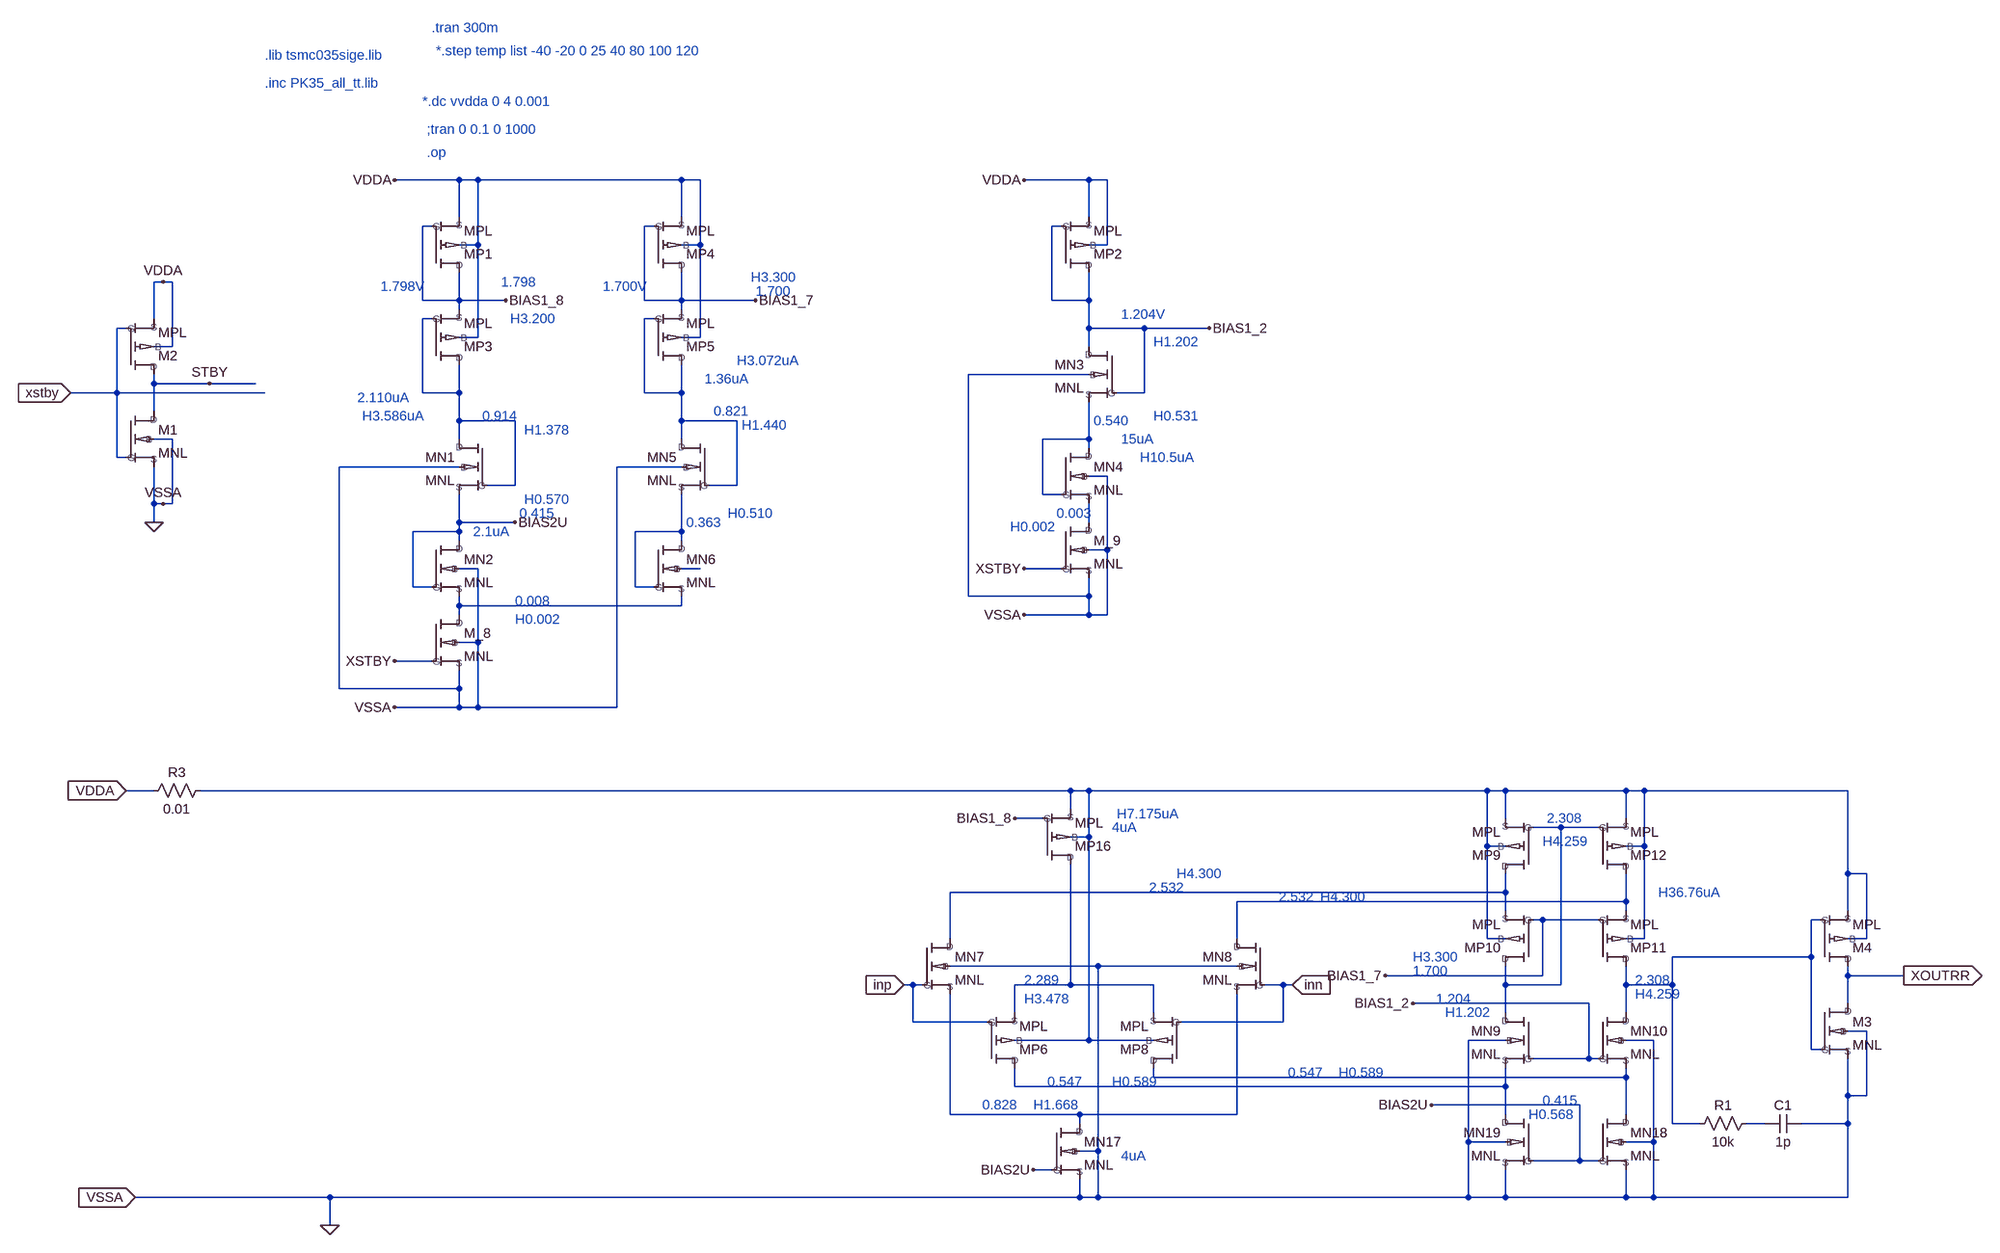
[diagram p0: schematic COMP_RR5V_orig.asc]
COMP_RR5V_orig.asc, the LTspice schematic file:
Version 4
SHEET 1 3512 5012
WIRE 352 1312 240 1312
WIRE 384 1312 352 1312
WIRE 736 1312 384 1312
WIRE 768 1312 736 1312
WIRE 1440 1312 1328 1312
WIRE 1472 1312 1440 1312
WIRE 352 1376 352 1312
WIRE 736 1376 736 1312
WIRE 1440 1376 1440 1312
WIRE 304 1392 288 1392
WIRE 688 1392 672 1392
WIRE 1392 1392 1376 1392
WIRE 384 1424 384 1312
WIRE 384 1424 352 1424
WIRE 768 1424 768 1312
WIRE 768 1424 736 1424
WIRE 1472 1424 1472 1312
WIRE 1472 1424 1440 1424
WIRE -160 1488 -176 1488
WIRE -144 1488 -160 1488
WIRE 288 1520 288 1392
WIRE 352 1520 352 1472
WIRE 352 1520 288 1520
WIRE 432 1520 352 1520
WIRE 672 1520 672 1392
WIRE 736 1520 736 1472
WIRE 736 1520 672 1520
WIRE 864 1520 736 1520
WIRE 1376 1520 1376 1392
WIRE 1440 1520 1440 1472
WIRE 1440 1520 1376 1520
WIRE 352 1536 352 1520
WIRE 736 1536 736 1520
WIRE -176 1552 -176 1488
WIRE 304 1552 288 1552
WIRE 688 1552 672 1552
WIRE -224 1568 -240 1568
WIRE 1440 1568 1440 1520
WIRE 1536 1568 1440 1568
WIRE 1648 1568 1536 1568
WIRE 384 1584 384 1424
WIRE 384 1584 352 1584
WIRE 768 1584 768 1424
WIRE 768 1584 736 1584
WIRE -144 1600 -144 1488
WIRE -144 1600 -176 1600
WIRE 1440 1600 1440 1568
WIRE 1440 1648 1232 1648
WIRE -176 1664 -176 1648
WIRE -80 1664 -176 1664
WIRE 0 1664 -80 1664
WIRE -240 1680 -240 1568
WIRE -240 1680 -320 1680
WIRE 16 1680 -240 1680
WIRE 288 1680 288 1552
WIRE 352 1680 352 1632
WIRE 352 1680 288 1680
WIRE 672 1680 672 1552
WIRE 736 1680 736 1632
WIRE 736 1680 672 1680
WIRE 1536 1680 1536 1568
WIRE 1536 1680 1488 1680
WIRE -176 1712 -176 1664
WIRE 352 1728 352 1680
WIRE 448 1728 352 1728
WIRE 736 1728 736 1680
WIRE 832 1728 736 1728
WIRE -144 1760 -176 1760
WIRE 352 1760 352 1728
WIRE 736 1760 736 1728
WIRE 1440 1760 1440 1696
WIRE 1440 1760 1360 1760
WIRE 1440 1776 1440 1760
WIRE -240 1792 -240 1680
WIRE -224 1792 -240 1792
WIRE 352 1808 144 1808
WIRE 736 1808 624 1808
WIRE 1472 1824 1440 1824
WIRE 448 1840 448 1728
WIRE 448 1840 400 1840
WIRE 832 1840 832 1728
WIRE 832 1840 784 1840
WIRE 1360 1856 1360 1760
WIRE 1392 1856 1360 1856
WIRE -176 1872 -176 1808
WIRE -160 1872 -176 1872
WIRE -144 1872 -144 1760
WIRE -144 1872 -160 1872
WIRE -176 1904 -176 1872
WIRE 352 1904 352 1856
WIRE 448 1904 352 1904
WIRE 1440 1904 1440 1872
WIRE 352 1920 352 1904
WIRE 352 1920 272 1920
WIRE 736 1920 736 1856
WIRE 736 1920 656 1920
WIRE 352 1936 352 1920
WIRE 736 1936 736 1920
WIRE 1472 1952 1472 1824
WIRE 1472 1952 1440 1952
WIRE 384 1984 352 1984
WIRE 768 1984 736 1984
WIRE 1392 1984 1328 1984
WIRE 272 2016 272 1920
WIRE 304 2016 272 2016
WIRE 656 2016 656 1920
WIRE 688 2016 656 2016
WIRE 1232 2032 1232 1648
WIRE 1440 2032 1440 2000
WIRE 1440 2032 1232 2032
WIRE 352 2048 352 2032
WIRE 736 2048 736 2032
WIRE 736 2048 352 2048
WIRE 352 2064 352 2048
WIRE 1440 2064 1440 2032
WIRE 1440 2064 1328 2064
WIRE 1472 2064 1472 1952
WIRE 1472 2064 1440 2064
WIRE 384 2112 384 1984
WIRE 384 2112 352 2112
WIRE 304 2144 240 2144
WIRE 144 2192 144 1808
WIRE 352 2192 352 2160
WIRE 352 2192 144 2192
WIRE 352 2224 352 2192
WIRE 352 2224 240 2224
WIRE 384 2224 384 2112
WIRE 384 2224 352 2224
WIRE 624 2224 624 1808
WIRE 624 2224 384 2224
WIRE -176 2368 -224 2368
WIRE 1408 2368 -96 2368
WIRE 1440 2368 1408 2368
WIRE 2128 2368 1440 2368
WIRE 2160 2368 2128 2368
WIRE 2368 2368 2160 2368
WIRE 2400 2368 2368 2368
WIRE 2752 2368 2400 2368
WIRE 1408 2400 1408 2368
WIRE 1360 2416 1312 2416
WIRE 2160 2416 2160 2368
WIRE 2368 2416 2368 2368
WIRE 2256 2432 2208 2432
WIRE 2320 2432 2256 2432
WIRE 1440 2448 1440 2368
WIRE 1440 2448 1408 2448
WIRE 2128 2464 2128 2368
WIRE 2160 2464 2128 2464
WIRE 2400 2464 2400 2368
WIRE 2400 2464 2368 2464
WIRE 2752 2512 2752 2368
WIRE 2784 2512 2752 2512
WIRE 2160 2544 2160 2512
WIRE 2160 2544 1200 2544
WIRE 2368 2560 2368 2512
WIRE 2368 2560 1696 2560
WIRE 2160 2576 2160 2544
WIRE 2368 2576 2368 2560
WIRE 2752 2576 2752 2512
WIRE 2224 2592 2208 2592
WIRE 2320 2592 2224 2592
WIRE 2704 2592 2688 2592
WIRE 1200 2624 1200 2544
WIRE 1696 2624 1696 2560
WIRE 2128 2624 2128 2464
WIRE 2160 2624 2128 2624
WIRE 2400 2624 2400 2464
WIRE 2400 2624 2368 2624
WIRE 2784 2624 2784 2512
WIRE 2784 2624 2752 2624
WIRE 2688 2656 2688 2592
WIRE 2688 2656 2448 2656
WIRE 1456 2672 1200 2672
WIRE 1696 2672 1456 2672
WIRE 2224 2688 2224 2592
WIRE 2224 2688 1952 2688
WIRE 2752 2688 2752 2672
WIRE 2848 2688 2752 2688
WIRE 1136 2704 1120 2704
WIRE 1152 2704 1136 2704
WIRE 1408 2704 1408 2496
WIRE 1408 2704 1312 2704
WIRE 1552 2704 1408 2704
WIRE 1776 2704 1744 2704
WIRE 1792 2704 1776 2704
WIRE 2160 2704 2160 2672
WIRE 2256 2704 2256 2432
WIRE 2256 2704 2160 2704
WIRE 2368 2704 2368 2672
WIRE 2448 2704 2448 2656
WIRE 2448 2704 2368 2704
WIRE 2304 2736 2000 2736
WIRE 2752 2736 2752 2688
WIRE 1312 2752 1312 2704
WIRE 1552 2752 1552 2704
WIRE 2160 2752 2160 2704
WIRE 2368 2752 2368 2704
WIRE 1136 2768 1136 2704
WIRE 1264 2768 1136 2768
WIRE 1776 2768 1776 2704
WIRE 1776 2768 1600 2768
WIRE 2784 2784 2752 2784
WIRE 1440 2800 1440 2448
WIRE 1440 2800 1312 2800
WIRE 1552 2800 1440 2800
WIRE 2160 2800 2096 2800
WIRE 2416 2800 2368 2800
WIRE 2688 2816 2688 2656
WIRE 2704 2816 2688 2816
WIRE 2304 2832 2304 2736
WIRE 2304 2832 2208 2832
WIRE 2320 2832 2304 2832
WIRE 1552 2864 1552 2848
WIRE 2368 2864 2368 2848
WIRE 2368 2864 1552 2864
WIRE 1312 2880 1312 2848
WIRE 2160 2880 2160 2848
WIRE 2160 2880 1312 2880
WIRE 2752 2896 2752 2832
WIRE 2784 2896 2784 2784
WIRE 2784 2896 2752 2896
WIRE 2288 2912 2032 2912
WIRE 1200 2928 1200 2720
WIRE 1424 2928 1200 2928
WIRE 1696 2928 1696 2720
WIRE 1696 2928 1424 2928
WIRE 2160 2928 2160 2880
WIRE 2368 2928 2368 2864
WIRE 1424 2944 1424 2928
WIRE 2448 2944 2448 2704
WIRE 2496 2944 2448 2944
WIRE 2608 2944 2576 2944
WIRE 2752 2944 2752 2896
WIRE 2752 2944 2672 2944
WIRE 2096 2976 2096 2800
WIRE 2160 2976 2096 2976
WIRE 2416 2976 2416 2800
WIRE 2416 2976 2368 2976
WIRE 1456 2992 1456 2672
WIRE 1456 2992 1424 2992
WIRE 2288 3008 2288 2912
WIRE 2288 3008 2208 3008
WIRE 2320 3008 2288 3008
WIRE 1376 3024 1344 3024
WIRE 128 3072 -208 3072
WIRE 1424 3072 1424 3040
WIRE 1424 3072 128 3072
WIRE 1456 3072 1456 2992
WIRE 1456 3072 1424 3072
WIRE 2096 3072 2096 2976
WIRE 2096 3072 1456 3072
WIRE 2160 3072 2160 3024
WIRE 2160 3072 2096 3072
WIRE 2368 3072 2368 3024
WIRE 2368 3072 2160 3072
WIRE 2416 3072 2416 2976
WIRE 2416 3072 2368 3072
WIRE 2752 3072 2752 2944
WIRE 2752 3072 2416 3072
WIRE 128 3120 128 3072
FLAG -320 1680 xstby
IOPIN -320 1680 In
FLAG -160 1488 VDDA
FLAG -160 1872 VSSA
FLAG -80 1664 STBY
FLAG -176 1904 0
FLAG 240 1312 VDDA
FLAG 240 2144 XSTBY
FLAG 240 2224 VSSA
FLAG 1328 1312 VDDA
FLAG 1328 1984 XSTBY
FLAG 1328 2064 VSSA
FLAG 1120 2704 inp
IOPIN 1120 2704 In
FLAG 1792 2704 inn
IOPIN 1792 2704 In
FLAG 128 3120 0
FLAG 448 1904 BIAS2U
FLAG 432 1520 BIAS1_8
FLAG 864 1520 BIAS1_7
FLAG 1648 1568 BIAS1_2
FLAG 2000 2736 BIAS1_2
FLAG 1952 2688 BIAS1_7
FLAG 1344 3024 BIAS2U
FLAG 1312 2416 BIAS1_8
FLAG 2032 2912 BIAS2U
FLAG 2848 2688 XOUTRR
IOPIN 2848 2688 Out
FLAG -224 2368 VDDA
IOPIN -224 2368 In
FLAG -208 3072 VSSA
IOPIN -208 3072 In
SYMBOL MNL -192 1760 R0
SYMATTR InstName M1
SYMATTR SpiceLine l=1.0u w=5.0u pd=w+l+l ps=pd ad=w*l as=ad m=1
SYMBOL MPL -192 1600 M180
SYMATTR InstName M2
SYMATTR SpiceLine l=1.0u w=10.0u pd=w+l+l ps=pd ad=w*l as=ad m=1
SYMBOL MPL 336 1424 M180
SYMATTR InstName MP1
SYMATTR SpiceLine l=22u w=3.3u pd=w+l+l ps=pd ad=w*l as=ad m=1
SYMBOL MNL 368 1808 M0
SYMATTR InstName MN1
SYMATTR SpiceLine l=10.u w=10.6u pd=w+l+l ps=pd ad=w*l as=ad m=1
SYMBOL MNL 336 1984 R0
SYMATTR InstName MN2
SYMATTR SpiceLine l=4.0u w=10.0u pd=w+l+l ps=pd ad=w*l as=ad m=1
SYMBOL MNL 336 2112 R0
SYMATTR InstName M_8
SYMATTR SpiceLine l=1.2u w=24u pd=w+l+l ps=pd ad=w*l as=ad m=1
SYMBOL MPL 1424 1424 M180
SYMATTR InstName MP2
SYMATTR SpiceLine l=40u w=3.3u pd=w+l+l ps=pd ad=w*l as=ad m=1
SYMBOL MNL 1456 1648 M0
SYMATTR InstName MN3
SYMATTR SpiceLine l=4u w=22u pd=w+l+l ps=pd ad=w*l as=ad m=2
SYMBOL MNL 1424 1824 R0
SYMATTR InstName MN4
SYMATTR SpiceLine l=4u w=22u pd=w+l+l ps=pd ad=w*l as=ad m=2
SYMBOL MNL 1424 1952 R0
SYMATTR InstName M_9
SYMATTR SpiceLine l=1.2u w=24u pd=w+l+l ps=pd ad=w*l as=ad m=1
SYMBOL MPL 336 1584 M180
SYMATTR InstName MP3
SYMATTR SpiceLine l=20u w=7.7u pd=w+l+l ps=pd ad=w*l as=ad m=1
SYMBOL MPL 720 1424 M180
SYMATTR InstName MP4
SYMATTR SpiceLine l=22u w=3.3u pd=w+l+l ps=pd ad=w*l as=ad m=1
SYMBOL MNL 752 1808 M0
SYMATTR InstName MN5
SYMATTR SpiceLine l=12u w=5.1u pd=w+l+l ps=pd ad=w*l as=ad m=1
SYMBOL MNL 720 1984 R0
SYMATTR InstName MN6
SYMATTR SpiceLine l=4.0u w=10.0u pd=w+l+l ps=pd ad=w*l as=ad m=1
SYMBOL MPL 720 1584 M180
SYMATTR InstName MP5
SYMATTR SpiceLine l=20u w=5.8u pd=w+l+l ps=pd ad=w*l as=ad m=1
SYMBOL MPL 1296 2800 M180
SYMATTR InstName MP6
SYMATTR SpiceLine l=2.0u w=45u pd=w+l+l ps=pd ad=w*l as=ad m=2
SYMBOL MNL 1184 2672 R0
SYMATTR InstName MN7
SYMATTR SpiceLine l=2.0u w=15u pd=w+l+l ps=pd ad=w*l as=ad m=2
SYMBOL MNL 1712 2672 M0
SYMATTR InstName MN8
SYMATTR SpiceLine l=2.0u w=15u pd=w+l+l ps=pd ad=w*l as=ad m=2
SYMBOL MPL 1568 2800 R180
SYMATTR InstName MP8
SYMATTR SpiceLine l=2.0u w=45u pd=w+l+l ps=pd ad=w*l as=ad m=2
SYMBOL MPL 2176 2464 R180
SYMATTR InstName MP9
SYMATTR SpiceLine l=2.0u w=90u pd=w+l+l ps=pd ad=w*l as=ad m=1
SYMBOL MPL 2176 2624 R180
SYMATTR InstName MP10
SYMATTR SpiceLine l=2.0u w=90u pd=w+l+l ps=pd ad=w*l as=ad m=2
SYMBOL MNL 2176 2800 M0
SYMATTR InstName MN9
SYMATTR SpiceLine l=4.0u w=22u pd=w+l+l ps=pd ad=w*l as=ad m=20
SYMBOL MNL 2352 2800 R0
SYMATTR InstName MN10
SYMATTR SpiceLine l=4.0u w=22u pd=w+l+l ps=pd ad=w*l as=ad m=20
SYMBOL MPL 2352 2624 M180
SYMATTR InstName MP11
SYMATTR SpiceLine l=2.0u w=90u pd=w+l+l ps=pd ad=w*l as=ad m=2
SYMBOL MPL 2352 2464 M180
SYMATTR InstName MP12
SYMATTR SpiceLine l=2.0u w=90u pd=w+l+l ps=pd ad=w*l as=ad m=1
SYMBOL res -80 2352 R90
WINDOW 0 0 56 VBottom 2
WINDOW 3 32 56 VTop 2
SYMATTR InstName R3
SYMATTR Value 0.01
SYMBOL MNL 1408 2992 R0
SYMATTR InstName MN17
SYMATTR SpiceLine l=4.0u w=10.0u pd=w+l+l ps=pd ad=w*l as=ad m=2
SYMBOL MPL 1392 2448 M180
SYMATTR InstName MP16
SYMATTR SpiceLine l=22u w=3.3u pd=w+l+l ps=pd ad=w*l as=ad m=2
SYMBOL MNL 2352 2976 R0
SYMATTR InstName MN18
SYMATTR SpiceLine l=4.0u w=10.0u pd=w+l+l ps=pd ad=w*l as=ad m=10
SYMBOL MNL 2176 2976 M0
SYMATTR InstName MN19
SYMATTR SpiceLine l=4.0u w=10.0u pd=w+l+l ps=pd ad=w*l as=ad m=10
SYMBOL MNL 2736 2784 R0
SYMATTR InstName M3
SYMATTR SpiceLine l=20u w=5.0u pd=w+l+l ps=pd ad=w*l as=ad m=1
SYMBOL MPL 2736 2624 M180
SYMATTR InstName M4
SYMATTR SpiceLine l=1.0u w=20.3u pd=w+l+l ps=pd ad=w*l as=ad m=7
SYMBOL res 2592 2928 R90
WINDOW 0 0 56 VBottom 2
WINDOW 3 32 56 VTop 2
SYMATTR InstName R1
SYMATTR Value 10k
SYMBOL cap 2672 2928 R90
WINDOW 0 0 32 VBottom 2
WINDOW 3 32 32 VTop 2
SYMATTR InstName C1
SYMATTR Value 1p
TEXT 296 1224 Left 2 ;;tran 0 0.1 0 1000
TEXT 288 1176 Left 2 ;*.dc vvdda 0 4 0.001
TEXT 312 1088 Left 2 ;*.step temp list -40 -20 0 25 40 80 100 120
TEXT 296 1264 Left 2 ;.op
TEXT 16 1144 Left 2 ;.inc PK35_all_tt.lib
TEXT 304 1048 Left 2 ;.tran 300m
TEXT 16 1096 Left 2 ;.lib tsmc035sige.lib
TEXT 216 1496 Left 2 ;1.798V
TEXT 600 1496 Left 2 ;1.700V
TEXT 376 1920 Left 2 ;2.1uA
TEXT 1496 1544 Left 2 ;1.204V
TEXT 1496 1760 Left 2 ;15uA
TEXT 1480 2432 Left 2 ;4uA
TEXT 1496 3000 Left 2 ;4uA
TEXT 1256 2912 Left 2 ;0.828
TEXT 1544 2536 Left 2 ;2.532
TEXT 1328 2696 Left 2 ;2.289
TEXT 1368 2872 Left 2 ;0.547
TEXT 1784 2856 Left 2 ;0.547
TEXT 1768 2552 Left 2 ;2.532
TEXT 2232 2416 Left 2 ;2.308
TEXT 2000 2680 Left 2 ;1.700
TEXT 2040 2728 Left 2 ;1.204
TEXT 2224 2904 Left 2 ;0.415
TEXT 2384 2696 Left 2 ;2.308
TEXT 424 1488 Left 2 ;1.798
TEXT 392 1720 Left 2 ;0.914
TEXT 456 1888 Left 2 ;0.415
TEXT 448 2040 Left 2 ;0.008
TEXT 744 1904 Left 2 ;0.363
TEXT 792 1712 Left 2 ;0.821
TEXT 864 1504 Left 2 ;1.700
TEXT 1384 1888 Left 2 ;0.003
TEXT 1448 1728 Left 2 ;0.540
TEXT 776 1656 Left 2 ;1.36uA
TEXT 176 1688 Left 2 ;2.110uA
TEXT 440 1552 Left 2 ;H3.200
TEXT 184 1720 Left 2 ;H3.586uA
TEXT 816 1888 Left 2 ;H0.510
TEXT 464 1744 Left 2 ;H1.378
TEXT 464 1864 Left 2 ;H0.570
TEXT 448 2072 Left 2 ;H0.002
TEXT 856 1480 Left 2 ;H3.300
TEXT 832 1624 Left 2 ;H3.072uA
TEXT 840 1736 Left 2 ;H1.440
TEXT 1552 1592 Left 2 ;H1.202
TEXT 1552 1720 Left 2 ;H0.531
TEXT 1304 1912 Left 2 ;H0.002
TEXT 1528 1792 Left 2 ;H10.5uA
TEXT 1488 2408 Left 2 ;H7.175uA
TEXT 1592 2512 Left 2 ;H4.300
TEXT 1840 2552 Left 2 ;H4.300
TEXT 1328 2728 Left 2 ;H3.478
TEXT 1480 2872 Left 2 ;H0.589
TEXT 1344 2912 Left 2 ;H1.668
TEXT 1872 2856 Left 2 ;H0.589
TEXT 2000 2656 Left 2 ;H3.300
TEXT 2056 2752 Left 2 ;H1.202
TEXT 2200 2928 Left 2 ;H0.568
TEXT 2384 2720 Left 2 ;H4.259
TEXT 2224 2456 Left 2 ;H4.259
TEXT 2424 2544 Left 2 ;H36.76uA

The netlist it stands for:
* COMP_RR5V_orig.asc
XM1 STBY xstby 0 0 MNL l=1.0u w=5.0u pd=w+l+l ps=pd ad=w*l as=ad m=1  ; pins D G S B
XM2 STBY xstby VDDA VDDA MPL l=1.0u w=10.0u pd=w+l+l ps=pd ad=w*l as=ad m=1  ; pins D G S B
XMP1 BIAS1_8 BIAS1_8 VDDA VDDA MPL l=22u w=3.3u pd=w+l+l ps=pd ad=w*l as=ad m=1  ; pins D G S B
XMN1 N001 N001 BIAS2U 0 MNL l=10.u w=10.6u pd=w+l+l ps=pd ad=w*l as=ad m=1  ; pins D G S B
XMN2 BIAS2U BIAS2U N007 0 MNL l=4.0u w=10.0u pd=w+l+l ps=pd ad=w*l as=ad m=1  ; pins D G S B
XM_8 N007 xstby 0 0 MNL l=1.2u w=24u pd=w+l+l ps=pd ad=w*l as=ad m=1  ; pins D G S B
XMP2 BIAS1_2 BIAS1_2 VDDA VDDA MPL l=40u w=3.3u pd=w+l+l ps=pd ad=w*l as=ad m=1  ; pins D G S B
XMN3 BIAS1_2 BIAS1_2 N003 0 MNL l=4u w=22u pd=w+l+l ps=pd ad=w*l as=ad m=2  ; pins D G S B
XMN4 N003 N003 N004 0 MNL l=4u w=22u pd=w+l+l ps=pd ad=w*l as=ad m=2  ; pins D G S B
XM_9 N004 xstby 0 0 MNL l=1.2u w=24u pd=w+l+l ps=pd ad=w*l as=ad m=1  ; pins D G S B
XMP3 N001 N001 BIAS1_8 VDDA MPL l=20u w=7.7u pd=w+l+l ps=pd ad=w*l as=ad m=1  ; pins D G S B
XMP4 BIAS1_7 BIAS1_7 VDDA VDDA MPL l=22u w=3.3u pd=w+l+l ps=pd ad=w*l as=ad m=1  ; pins D G S B
XMN5 N002 N002 N005 0 MNL l=12u w=5.1u pd=w+l+l ps=pd ad=w*l as=ad m=1  ; pins D G S B
XMN6 N005 N005 N007 N006 MNL l=4.0u w=10.0u pd=w+l+l ps=pd ad=w*l as=ad m=1  ; pins D G S B
XMP5 N002 N002 BIAS1_7 VDDA MPL l=20u w=5.8u pd=w+l+l ps=pd ad=w*l as=ad m=1  ; pins D G S B
XMP6 N015 inp N013 N008 MPL l=2.0u w=45u pd=w+l+l ps=pd ad=w*l as=ad m=2  ; pins D G S B
XMN7 N010 inp N016 0 MNL l=2.0u w=15u pd=w+l+l ps=pd ad=w*l as=ad m=2  ; pins D G S B
XMN8 N011 inn N016 0 MNL l=2.0u w=15u pd=w+l+l ps=pd ad=w*l as=ad m=2  ; pins D G S B
XMP8 N014 inn N013 N008 MPL l=2.0u w=45u pd=w+l+l ps=pd ad=w*l as=ad m=2  ; pins D G S B
XMP9 N010 N009 N008 N008 MPL l=2.0u w=90u pd=w+l+l ps=pd ad=w*l as=ad m=1  ; pins D G S B
XMP10 N009 BIAS1_7 N010 N008 MPL l=2.0u w=90u pd=w+l+l ps=pd ad=w*l as=ad m=2  ; pins D G S B
XMN9 N009 BIAS1_2 N015 0 MNL l=4.0u w=22u pd=w+l+l ps=pd ad=w*l as=ad m=20  ; pins D G S B
XMN10 N012 BIAS1_2 N014 0 MNL l=4.0u w=22u pd=w+l+l ps=pd ad=w*l as=ad m=20  ; pins D G S B
XMP11 N012 BIAS1_7 N011 N008 MPL l=2.0u w=90u pd=w+l+l ps=pd ad=w*l as=ad m=2  ; pins D G S B
XMP12 N011 N009 N008 N008 MPL l=2.0u w=90u pd=w+l+l ps=pd ad=w*l as=ad m=1  ; pins D G S B
R3 N008 VDDA 0.01
XMN17 N016 BIAS2U 0 0 MNL l=4.0u w=10.0u pd=w+l+l ps=pd ad=w*l as=ad m=2  ; pins D G S B
XMP16 N013 BIAS1_8 N008 N008 MPL l=22u w=3.3u pd=w+l+l ps=pd ad=w*l as=ad m=2  ; pins D G S B
XMN18 N014 BIAS2U 0 0 MNL l=4.0u w=10.0u pd=w+l+l ps=pd ad=w*l as=ad m=10  ; pins D G S B
XMN19 N015 BIAS2U 0 0 MNL l=4.0u w=10.0u pd=w+l+l ps=pd ad=w*l as=ad m=10  ; pins D G S B
XM3 XOUTRR N012 0 0 MNL l=20u w=5.0u pd=w+l+l ps=pd ad=w*l as=ad m=1  ; pins D G S B
XM4 XOUTRR N012 N008 N008 MPL l=1.0u w=20.3u pd=w+l+l ps=pd ad=w*l as=ad m=7  ; pins D G S B
R1 N017 N012 10k
C1 0 N017 1p
* ;tran 0 0.1 0 1000
* *.dc vvdda 0 4 0.001
* *.step temp list -40 -20 0 25 40 80 100 120
* .op
* .inc PK35_all_tt.lib
* .tran 300m
* .lib tsmc035sige.lib
* 1.798V
* 1.700V
* 2.1uA
* 1.204V
* 15uA
* 4uA
* 4uA
* 0.828
* 2.532
* 2.289
* 0.547
* 0.547
* 2.532
* 2.308
* 1.700
* 1.204
* 0.415
* 2.308
* 1.798
* 0.914
* 0.415
* 0.008
* 0.363
* 0.821
* 1.700
* 0.003
* 0.540
* 1.36uA
* 2.110uA
* H3.200
* H3.586uA
* H0.510
* H1.378
* H0.570
* H0.002
* H3.300
* H3.072uA
* H1.440
* H1.202
* H0.531
* H0.002
* H10.5uA
* H7.175uA
* H4.300
* H4.300
* H3.478
* H0.589
* H1.668
* H0.589
* H3.300
* H1.202
* H0.568
* H4.259
* H4.259
* H36.76uA
.backanno
.end